# EAGLE schematic button32 (EAGLE 9.3.0)
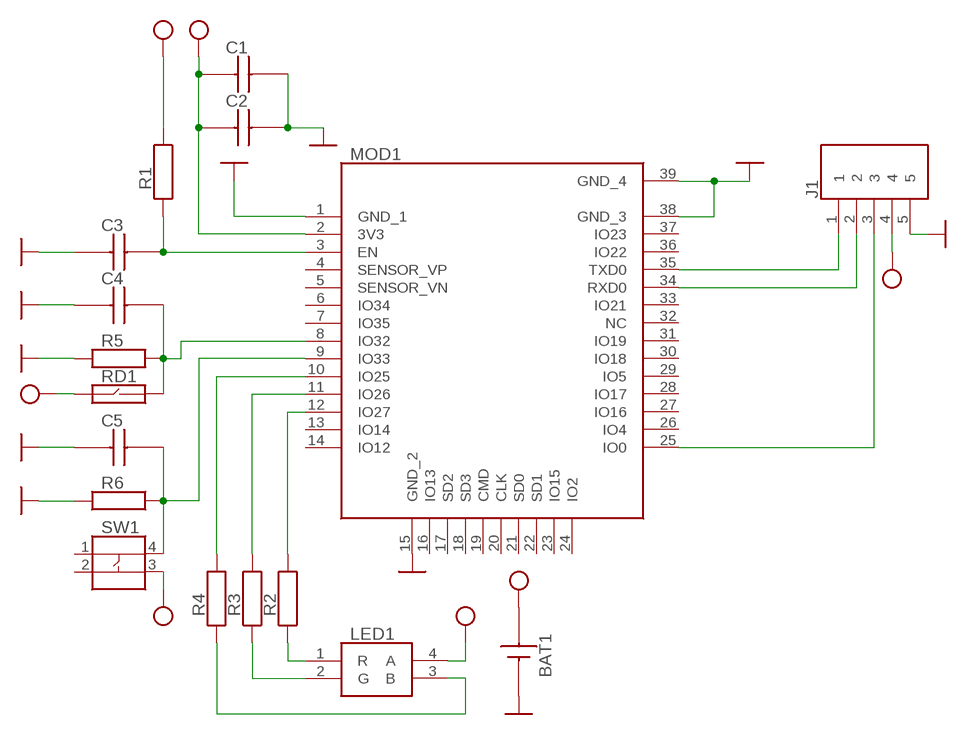
[diagram p0: schematic, sheet 1]

## Parts
BAT1  BH-411-1P24  [BH-411-1P24]
C1  CAPACITOR-0603  [0603]
C2  CAPACITOR-0603  [0603]
C3  CAPACITOR-0603  [0603]
C4  CAPACITOR-0603  [0603]
C5  CAPACITOR-0603  [0603]
J1  HEADER-5P-DıP-2_54MM  [HEADER-5P-DıP-2_54MM]
LED1  LED-RGB-3528-PLCC4  [LED-RGB-3528-PLCC4]
MOD1  ESP32-WROOM-32D  [ESP32-WROOM-32D]
R1  RESISTOR-0603  [0603]
R2  RESISTOR-0603  [0603]
R3  RESISTOR-0603  [0603]
R4  RESISTOR-0603  [0603]
R5  RESISTOR-0603  [0603]
R6  RESISTOR-0603  [0603]
RD1  REED  [0603]
SW1  BUTTON-4P-SMD-5X5  [BUTTON-4P-SMD-5X5]

## Nets
GND: BAT1.2(-) C1.2 C2.2 C3.1 C4.1 C5.1 J1.5 MOD1.1(GND_1) MOD1.15(GND_2) MOD1.38(GND_3) MOD1.39(GND_4) R5.1 R6.1
N$1: C3.2 MOD1.3(EN) R1.1
N$2: J1.1 MOD1.35(TXD0)
N$3: J1.2 MOD1.34(RXD0)
N$4: J1.3 MOD1.25(IO0)
N$5: LED1.1(R) R2.1
N$6: LED1.2(G) R3.1
N$7: LED1.3(B) R4.1
N$8: C4.2 MOD1.8(IO32) R5.2 RD1.2
N$10: MOD1.12(IO27) R2.2
N$11: MOD1.11(IO26) R3.2
N$12: MOD1.10(IO25) R4.2
N$13: C5.2 MOD1.9(IO33) R6.2 SW1.4
VCC: BAT1.1(+) C1.1 C2.1 J1.4 LED1.4(A) MOD1.2(3V3) R1.2 RD1.1 SW1.3
Unconnected: MOD1.4(SENSOR_VP) MOD1.5(SENSOR_VN) MOD1.6(IO34) MOD1.7(IO35) MOD1.13(IO14) MOD1.14(IO12) MOD1.16(IO13) MOD1.17(SD2) MOD1.18(SD3) MOD1.19(CMD) MOD1.20(CLK) MOD1.21(SD0) MOD1.22(SD1) MOD1.23(IO15) MOD1.24(IO2) MOD1.26(IO4) MOD1.27(IO16) MOD1.28(IO17) MOD1.29(IO5) MOD1.30(IO18) MOD1.31(IO19) MOD1.32(NC) MOD1.33(IO21) MOD1.36(IO22) MOD1.37(IO23) SW1.1 SW1.2

## Library data of the parts
BAT1 = SamacSys_Parts:BH-411-1P24
C1-C5 = SamacSys_Parts:CAPACITOR-0603
J1 = SamacSys_Parts:HEADER-5P-DıP-2_54MM
LED1 = SamacSys_Parts:LED-RGB-3528-PLCC4
MOD1 = SamacSys_Parts:ESP32-WROOM-32D
R1-R6 = SamacSys_Parts:RESISTOR-0603
RD1 = SamacSys_Parts:REED
SW1 = SamacSys_Parts:BUTTON-4P-SMD-5X5: SparkFun Accessories Mini Pushbutton Switch - SMD Source: Datasheet <https://www.sparkfun.com/datasheets/Components/Buttons/SMD-Button.pdf>